# EAGLE design EMI_Detect_V1.0 (EAGLE 7.6.0)
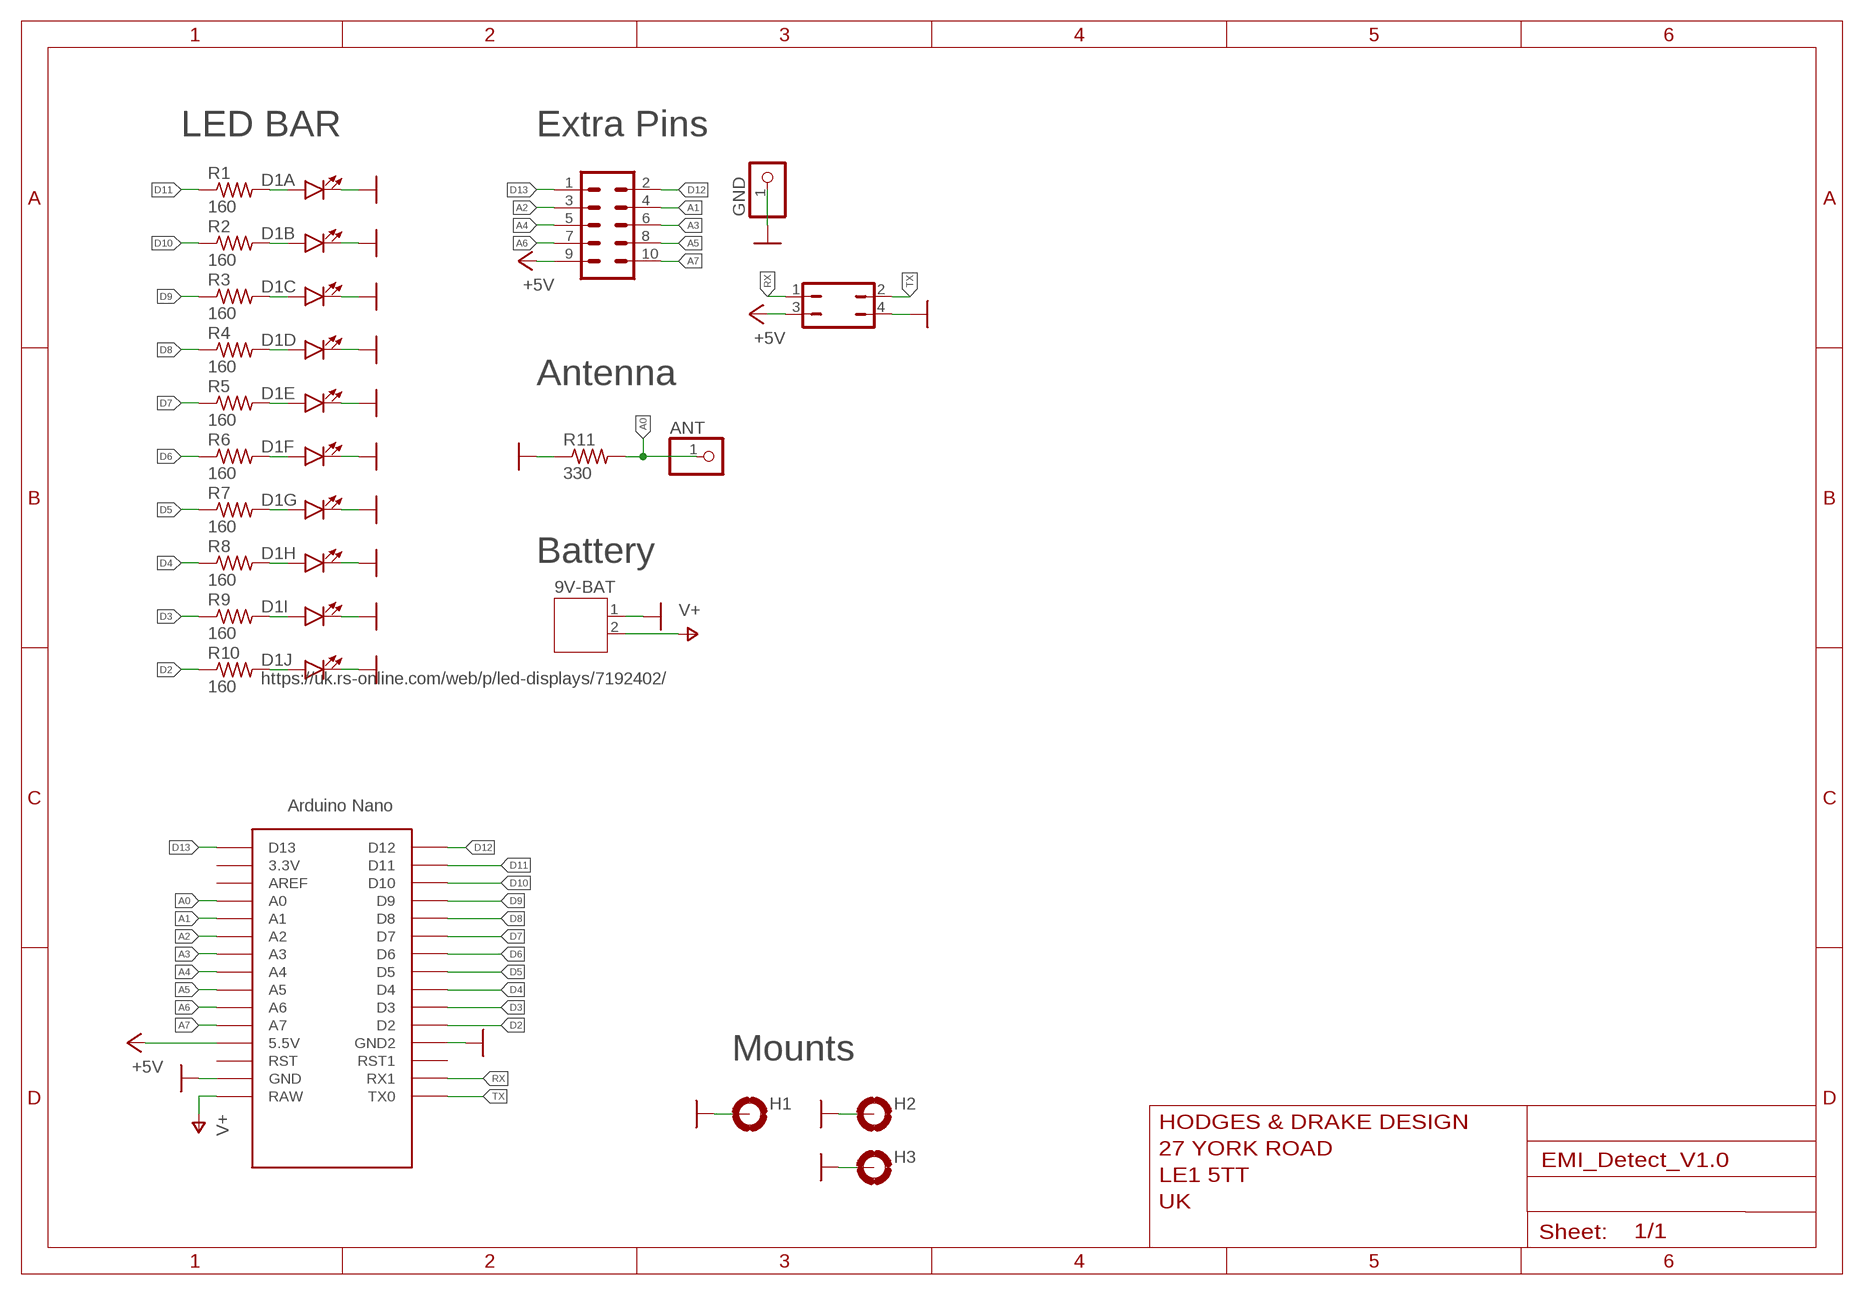
[diagram p0: schematic, sheet 1]

## Parts
9V-BAT  JST-PH2  [JST-PH2-S2B]
ANT  PINHD-1X1  [1X01]
D1  https://uk.rs-online.com/web/p/led-displays/7192402/  LED_BARGRAPH_10  [LED_BARGAPH_10]
GND  PINHD-1X1  [1X01]
H1  MOUNT-PAD-ROUND2.8  [2,8-PAD]
H2  MOUNT-PAD-ROUND2.8  [2,8-PAD]
H3  MOUNT-PAD-ROUND2.8  [2,8-PAD]
JP1  M05X2PTH  [AVR_ICSP]
JP2  JP2Q  [JP2Q]
R1  160  R-US_FLIPFLOP  [0805-THM]
R2  160  R-US_FLIPFLOP  [0805-THM]
R3  160  R-US_FLIPFLOP  [0805-THM]
R4  160  R-US_FLIPFLOP  [0805-THM]
R5  160  R-US_FLIPFLOP  [0805-THM]
R6  160  R-US_FLIPFLOP  [0805-THM]
R7  160  R-US_FLIPFLOP  [0805-THM]
R8  160  R-US_FLIPFLOP  [0805-THM]
R9  160  R-US_FLIPFLOP  [0805-THM]
R10  160  R-US_FLIPFLOP  [0805-THM]
R11  330  R-US_FLIPFLOP  [0805-THM]
U$1  NANO  [NANO]

## Nets
+5V: JP1.9 JP2.3 U$1.5V(5.5V)
A0: ANT.1 R11.2 U$1.A0
A1: JP1.4 U$1.A1
A2: JP1.3 U$1.A2
A3: JP1.6 U$1.A3
A4: JP1.5 U$1.A4
A5: JP1.8 U$1.A5
A6: JP1.7 U$1.A6
A7: JP1.10 U$1.A7
D2: R10.1 U$1.D2
D3: R9.1 U$1.D3
D4: R8.1 U$1.D4
D5: R7.1 U$1.D5
D6: R6.1 U$1.D6
D7: R5.1 U$1.D7
D8: R4.1 U$1.D8
D9: R3.1 U$1.D9
D10: R2.1 U$1.D10
D11: R1.1 U$1.D11
D12: JP1.2 U$1.D12
D13: JP1.1 U$1.D13
GND: 9V-BAT.1 D1.11(J:C) D1.12(I:C) D1.13(H:C) D1.14(G:C) D1.15(F:C) D1.16(E:C) D1.17(D:C) D1.18(C:C) D1.19(B:C) D1.20(A:C) GND.1 H1.B2,8(MOUNT) H2.B2,8(MOUNT) H3.B2,8(MOUNT) JP2.4 R11.1 U$1.GND U$1.GND1(GND2)
N$1: D1.1(A:A) R1.2
N$2: D1.2(B:A) R2.2
N$3: D1.3(C:A) R3.2
N$4: D1.4(D:A) R4.2
N$5: D1.5(E:A) R5.2
N$6: D1.6(F:A) R6.2
N$7: D1.7(G:A) R7.2
N$8: D1.8(H:A) R8.2
N$9: D1.9(I:A) R9.2
N$10: D1.10(J:A) R10.2
RX: JP2.1 U$1.RX1
TX: JP2.2 U$1.TX0
V+: 9V-BAT.2 U$1.RAW
Unconnected: U$1.3.3V U$1.AREF U$1.ICSP1 U$1.ICSP2 U$1.ICSP3 U$1.ICSP4 U$1.ICSP5 U$1.ICSP6 U$1.RST U$1.RST1

## Notes on the sheet
- LED BAR | Extra Pins
- Antenna
- Battery
- Mounts

## Library data of the parts
9V-BAT = con-jst-ph:JST-PH2
ANT GND = adafruit:PINHD-1X1: Pin header 1x1 for 0.1" spacing With round pins
D1 = SparkFun-LED:LED_BARGRAPH_10: 10-Segment LED Bar Graph SFE part numbers: COM-09935 (red, Vf = 2.1V, Ifmax = 20mA) COM-09936 (yellow, Vf = 2.1V, Ifmax = 20mA) COM-09937 (blue, Vf = 3.4V, Ifmax = 20mA) COM-09938 (green, Vf = 3.4V, Ifmax = 20mA)
H1-H3 = holes:MOUNT-PAD-ROUND: MOUNTING PAD, round
JP1 = SparkFun:M05X2: Header 5x2 Standard 10-pin dual row 0.1" header. Commonly used with AVR-ISP. Use with Spark Fun Electronics SKU: PRT-00778
JP2 = jumper:JP2Q: JUMPER
R1-R11 = adafruit:R-US_: RESISTOR, American symbol
U$1 = Arduino-clone:NANO: Arduino Nano

## Board
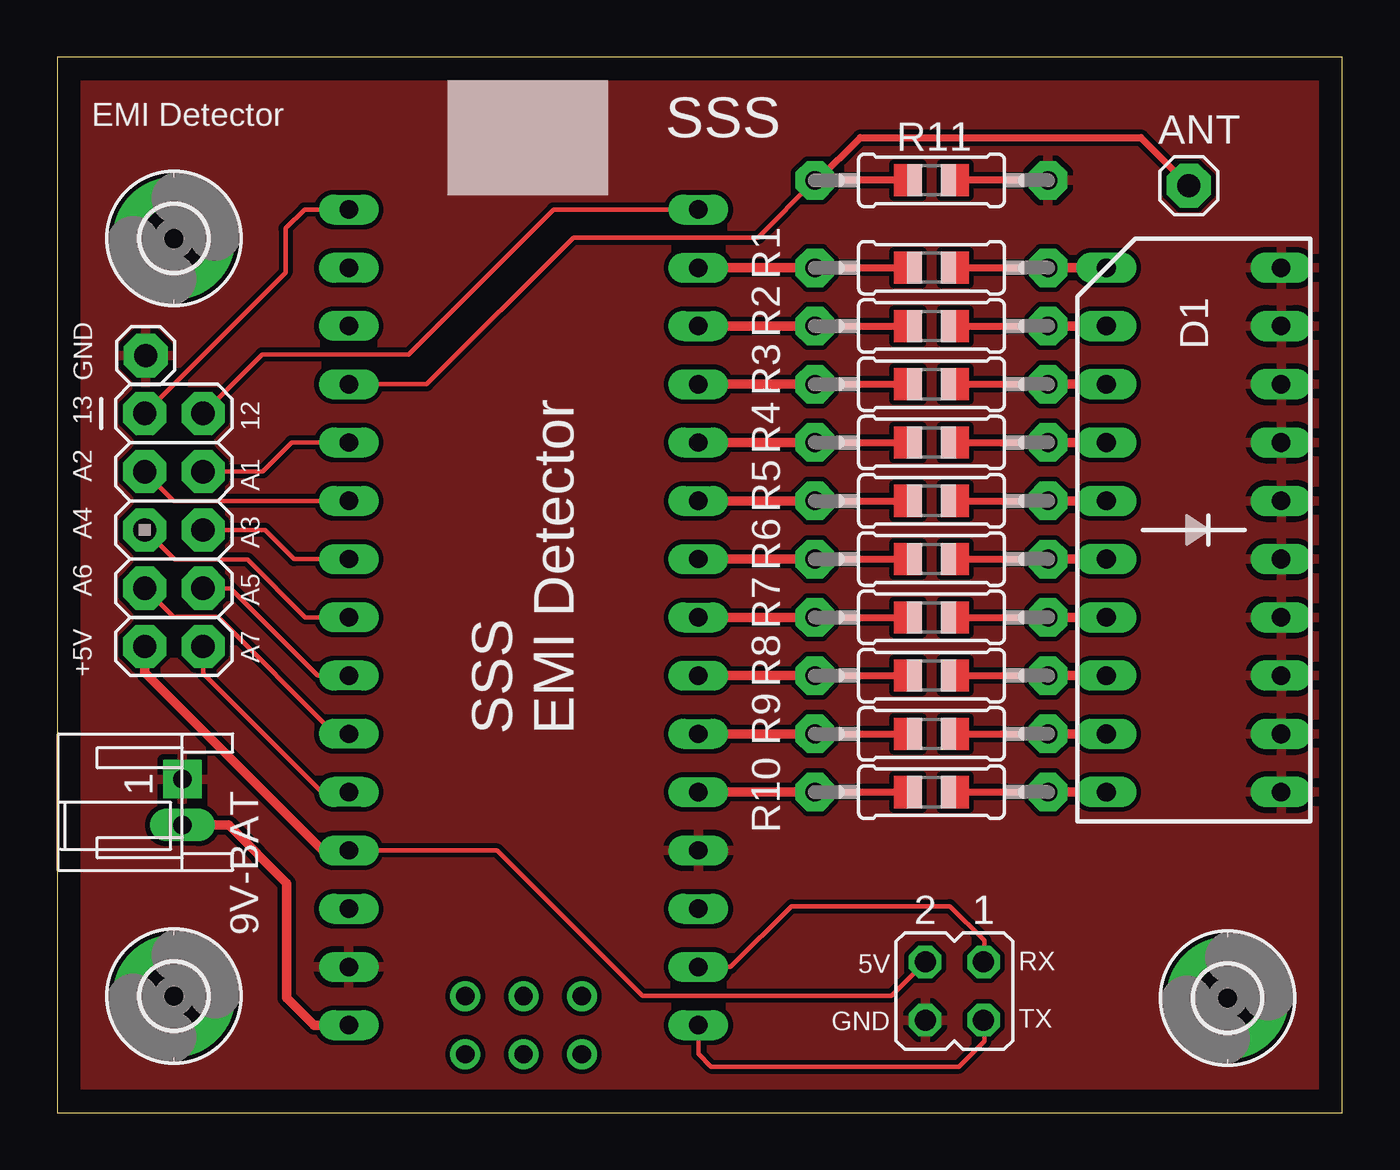
[diagram p1: board, top side]

Size 56 x 46 mm. Coordinates in mm from the lower left corner, seen from the top.
Outline: 0,0 56,0 56,46 0,46 0,0
Copper layers (1*16): Top 0.035mm / dielectric 1.5mm / Bottom 0.035mm
Design rules "default": minimum track width 10mil, minimum drill 24mil, track to track 8mil, track to pad 8mil, pad to pad 8mil, via to via 8mil, smd to smd 8mil, copper to edge 40mil, drill to drill 8mil, minimum pad ring 10mil, minimum via ring 8mil, stop-mask expansion 4mil, vias tented up to drill 0mil, thermal gap 10mil

### Footprints (pad centres in the part's own frame; a part is rotated, then mirrored left to right if it is on the bottom)
JST-PH2-S2B = drill 0.813 pad 1.676 square: 1 -1.977,2.169 | drill 0.813 pad 1.422 long: 2 -3.977,2.169
1X01 = drill 1.016 pad 1.93 octagon: 1 0,0
LED_BARGAPH_10 = drill 0.813 long: 1 -11.43,-3.81; 2 -8.89,-3.81; 3 -6.35,-3.81; 4 -3.81,-3.81; 5 -1.27,-3.81; 6 1.27,-3.81; 7 3.81,-3.81; 8 6.35,-3.81; 9 8.89,-3.81; 10 11.43,-3.81; 11 11.43,3.81; 12 8.89,3.81; 13 6.35,3.81; 14 3.81,3.81; 15 1.27,3.81; 16 -1.27,3.81; 17 -3.81,3.81; 18 -6.35,3.81; 19 -8.89,3.81; 20 -11.43,3.81
2,8-PAD = drill 2.8 pad 5.334: B2,8 0,0
AVR_ICSP = drill 1.016 pad 1.88 octagon: 1 -1.27,5.08; 2 1.27,5.08; 3 -1.27,2.54; 4 1.27,2.54; 5 -1.27,0; 6 1.27,0; 7 -1.27,-2.54; 8 1.27,-2.54; 9 -1.27,-5.08; 10 1.27,-5.08
JP2Q = drill 0.914 octagon: 1 -1.27,-1.27; 2 -1.27,1.27; 3 1.27,-1.27; 4 1.27,1.27
0805-THM = drill 0.813 pad 1.676 octagon: 1 -5.08,0; 2 5.08,0
NANO = drill 0.8 long: 3.3V -10.16,24.13; 5V -10.16,-1.27; A0 -10.16,19.05; A1 -10.16,16.51; A2 -10.16,13.97; A3 -10.16,11.43; A4 -10.16,8.89; A5 -10.16,6.35; A6 -10.16,3.81; A7 -10.16,1.27; AREF -10.16,21.59; D2 5.08,1.27; D3 5.08,3.81; D4 5.08,6.35; D5 5.08,8.89; D6 5.08,11.43; D7 5.08,13.97; D8 5.08,16.51; D9 5.08,19.05; D10 5.08,21.59; D11 5.08,24.13; D12 5.08,26.67; D13 -10.16,26.67; GND -10.16,-6.35; GND1 5.08,-1.27; RAW -10.16,-8.89; RST -10.16,-3.81; RST1 5.08,-3.81; RX1 5.08,-6.35; TX0 5.08,-8.89 | drill 0.8: ICSP1 -5.08,-10.16; ICSP2 -5.08,-7.62; ICSP3 -2.54,-10.16; ICSP4 -2.54,-7.62; ICSP5 0,-10.16; ICSP6 0,-7.62

### Placement (x,y rotation side)
9V-BAT  7.62,16.51 90 top
ANT  49.32,40.41 0 top
D1  49.53,25.4 270 top
GND  3.85,33 90 top
H1  5.08,5.08 0 top
H2  51,5 0 top
H3  5.08,38.1 0 top
JP1  5.08,25.4 0 top
JP2  39.1,5.3 180 top
R1  38.1,36.83 0 top
R2  38.1,34.29 0 top
R3  38.1,31.75 0 top
R4  38.1,29.21 0 top
R5  38.1,26.67 0 top
R6  38.1,24.13 0 top
R7  38.1,21.59 0 top
R8  38.1,19.05 0 top
R9  38.1,16.51 0 top
R10  38.1,13.97 0 top
R11  38.1,40.64 180 top
U$1  22.86,12.7 0 top

### Tracks (layer width: path | path; a pad name or v marks a point on that pad's centre or on a via)
+5V
  Top 0.2: U$1.5V 19.17,11.43 25.5,5.1 36.36,5.1 JP2.3
  Top 0.406: U$1.5V 11.57,11.43 3.81,19.19 JP1.9
A0
  Top 0.2: U$1.A0 16.1,31.75 22.5,38.15 30.53,38.15 R11.2
  Top 0.305: R11.2 33.14,40.64 35,42.5 47.23,42.5 ANT.1
A1
  Top 0.2: U$1.A1 10.21,29.21 8.95,27.95 JP1.4
A2
  Top 0.2: U$1.A2 5.08,26.67 JP1.3
A3
  Top 0.2: U$1.A3 10.32,24.13 9.05,25.4 JP1.6
A4
  Top 0.2: U$1.A4 10.81,21.59 8.3,24.1 5.11,24.1 JP1.5
A5
  Top 0.2: U$1.A5 11.35,19.05 7.55,22.85 JP1.8
A6
  Top 0.2: U$1.A6 12.09,16.51 7,21.6 5.07,21.6 JP1.7
A7
  Top 0.2: U$1.A7 11.53,13.97 6.35,19.15 JP1.10
D2
  Top 0.406: U$1.D2 R10.1
D3
  Top 0.406: U$1.D3 R9.1
D4
  Top 0.406: U$1.D4 R8.1
D5
  Top 0.406: U$1.D5 R7.1
D6
  Top 0.406: U$1.D6 R6.1
D7
  Top 0.406: U$1.D7 R5.1
D8
  Top 0.406: U$1.D8 R4.1
D9
  Top 0.406: U$1.D9 R3.1
D10
  Top 0.406: U$1.D10 R2.1
D11
  Top 0.406: R1.1 U$1.D11
D12
  Top 0.2: U$1.D12 21.62,39.37 15.3,33.05 8.92,33.05 JP1.2
D13
  Top 0.2: U$1.D13 10.77,39.37 9.95,38.55 9.95,36.62 JP1.1
GND
  pour Top: 0,0 0,46 56,46 56,0
N$1
  Top 0.406: R1.2 D1.1
N$2
  Top 0.406: R2.2 D1.2
N$3
  Top 0.406: R3.2 D1.3
N$4
  Top 0.406: R4.2 D1.4
N$5
  Top 0.406: R5.2 D1.5
N$6
  Top 0.406: R6.2 D1.6
N$7
  Top 0.406: R7.2 D1.7
N$8
  Top 0.406: R8.2 D1.8
N$9
  Top 0.406: R9.2 D1.9
N$10
  Top 0.406: R10.2 D1.10
RX
  Top 0.2: U$1.RX1 29.35,6.35 32,9 38.9,9 40.4,7.5 40.4,6.6 JP2.1
TX
  Top 0.2: U$1.TX0 27.94,2.56 28.5,2 39.3,2 40.4,3.1 40.4,4 JP2.2
V+
  Top 0.406: U$1.RAW 11.19,3.81 10,5 10,10 7.47,12.53 9V-BAT.2

### Text on the board
tPlace: EMI Detector | SSS | 12 | 13 | A2 | A1 | A3 | A4 | A5 | A6 | A7 | +5V | SSS / EMI Detector | 5V | RX | GND | TX